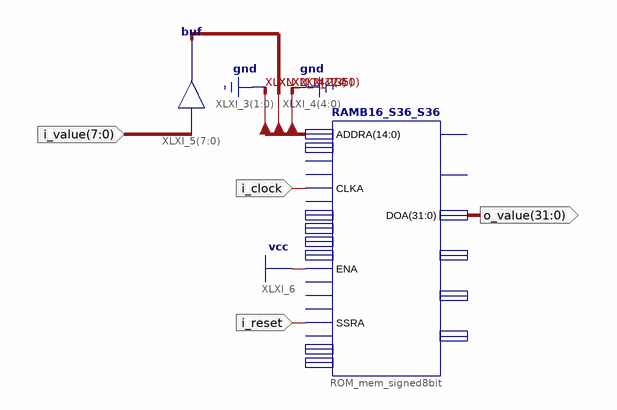
[diagram p0: schematic sheet 1]
// Xilinx ISE schematic rom_signed8bit.sch (spartan3e) as structural Verilog: 2 symbols, 4 ports
module rom_signed8bit (
  input  [7:0] i_value,
  input  i_clock,
  input  i_reset,
  output [31:0] o_value
);

  wire [12:5] XLXN_2;

  RAMB16_S36_S36 #(.WRITE_WIDTH_B(36), .WRITE_WIDTH_A(36), .WRITE_MODE_B("READ_FIRST"), .WRITE_MODE_A("READ_FIRST"), .READ_WIDTH_B(36), .READ_WIDTH_A(36), .INIT_1F("bf800000c0000000c0400000c0800000c0a00000c0c00000c0e00000c1000000"), .INIT_1E("c1100000c1200000c1300000c1400000c1500000c1600000c1700000c1800000"), .INIT_1D("c1880000c1900000c1980000c1a00000c1a80000c1b00000c1b80000c1c00000"), .INIT_1C("c1c80000c1d00000c1d80000c1e00000c1e80000c1f00000c1f80000c2000000"), .INIT_1B("c2040000c2080000c20c0000c2100000c2140000c2180000c21c0000c2200000"), .INIT_1A("c2240000c2280000c22c0000c2300000c2340000c2380000c23c0000c2400000"), .INIT_19("c2440000c2480000c24c0000c2500000c2540000c2580000c25c0000c2600000"), .INIT_18("c2640000c2680000c26c0000c2700000c2740000c2780000c27c0000c2800000"), .INIT_17("c2820000c2840000c2860000c2880000c28a0000c28c0000c28e0000c2900000"), .INIT_16("c2920000c2940000c2960000c2980000c29a0000c29c0000c29e0000c2a00000"), .INIT_15("c2a20000c2a40000c2a60000c2a80000c2aa0000c2ac0000c2ae0000c2b00000"), .INIT_14("c2b20000c2b40000c2b60000c2b80000c2ba0000c2bc0000c2be0000c2c00000"), .INIT_13("c2c20000c2c40000c2c60000c2c80000c2ca0000c2cc0000c2ce0000c2d00000"), .INIT_12("c2d20000c2d40000c2d60000c2d80000c2da0000c2dc0000c2de0000c2e00000"), .INIT_11("c2e20000c2e40000c2e60000c2e80000c2ea0000c2ec0000c2ee0000c2f00000"), .INIT_10("c2f20000c2f40000c2f60000c2f80000c2fa0000c2fc0000c2fe0000c3000000"), .INIT_0F("42fe000042fc000042fa000042f8000042f6000042f4000042f2000042f00000"), .INIT_0E("42ee000042ec000042ea000042e8000042e6000042e4000042e2000042e00000"), .INIT_0D("42de000042dc000042da000042d8000042d6000042d4000042d2000042d00000"), .INIT_0C("42ce000042cc000042ca000042c8000042c6000042c4000042c2000042c00000"), .INIT_0B("42be000042bc000042ba000042b8000042b6000042b4000042b2000042b00000"), .INIT_0A("42ae000042ac000042aa000042a8000042a6000042a4000042a2000042a00000"), .INIT_09("429e0000429c0000429a00004298000042960000429400004292000042900000"), .INIT_08("428e0000428c0000428a00004288000042860000428400004282000042800000"), .INIT_07("427c0000427800004274000042700000426c0000426800004264000042600000"), .INIT_06("425c0000425800004254000042500000424c0000424800004244000042400000"), .INIT_05("423c0000423800004234000042300000422c0000422800004224000042200000"), .INIT_04("421c0000421800004214000042100000420c0000420800004204000042000000"), .INIT_03("41f8000041f0000041e8000041e0000041d8000041d0000041c8000041c00000"), .INIT_02("41b8000041b0000041a8000041a0000041980000419000004188000041800000"), .INIT_01("4170000041600000415000004140000041300000412000004110000041000000"), .INIT_00("40e0000040c0000040a000004080000040400000400000003f80000022000000")) ROM_mem_signed8bit (
    .ADDRA({2'b00, XLXN_2, {5{1'b0}}}), .CLKA(i_clock), .ENA(1'b1), .SSRA(i_reset), .DOA(o_value));  // open: ADDRB, CASCADEINA, CASCADEINB, CLKB, DIA, DIB, DIPA, DIPB, REGCEA, REGCEB, ENB, SSRB, WEA, WEB, CASCADEOUTA, CASCADEOUTB, DOB, DOPA, DOPB
  assign XLXN_2 = i_value;  // buf XLXI_5[7..0], 8 bits wide
endmodule
